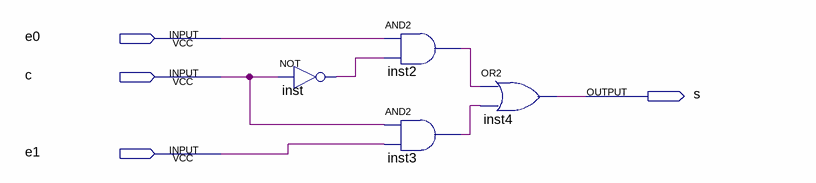
[diagram p0: schematic sheet]
// Quartus schematic mux_2x1.bdf as structural Verilog: 4 symbols, 4 pins
module mux_2x1 (
  input  e0,
  input  c,
  input  e1,
  output s
);

  wire inst2_out, inst3_out, inst_out;

  not inst (inst_out, c);
  and inst2 (inst2_out, e0, inst_out);
  and inst3 (inst3_out, c, e1);
  or inst4 (s, inst2_out, inst3_out);
endmodule
